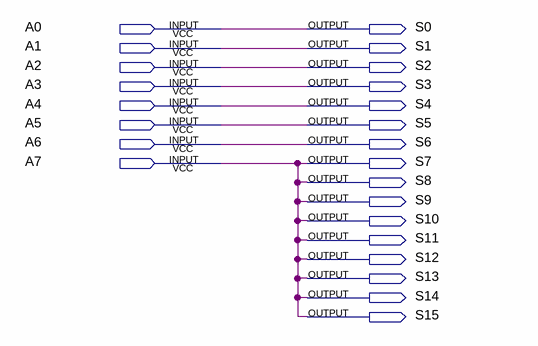
[diagram p0: schematic sheet]
// Quartus schematic ExtensordeSinal.bdf as structural Verilog: 0 symbols, 24 pins
module ExtensordeSinal (
  input  A0,
  input  A1,
  input  A2,
  input  A3,
  input  A4,
  input  A5,
  input  A6,
  input  A7,
  output S0,
  output S1,
  output S2,
  output S3,
  output S4,
  output S5,
  output S6,
  output S7,
  output S8,
  output S9,
  output S10,
  output S11,
  output S12,
  output S13,
  output S14,
  output S15
);


  assign S0 = A0;
  assign S1 = A1;
  assign S2 = A2;
  assign S3 = A3;
  assign S4 = A4;
  assign S5 = A5;
  assign S6 = A6;
  assign S7 = A7;
  assign S8 = A7;
  assign S9 = A7;
  assign S10 = A7;
  assign S11 = A7;
  assign S12 = A7;
  assign S13 = A7;
  assign S14 = A7;
  assign S15 = A7;
endmodule
